# EAGLE design prg (EAGLE 7.1.0)
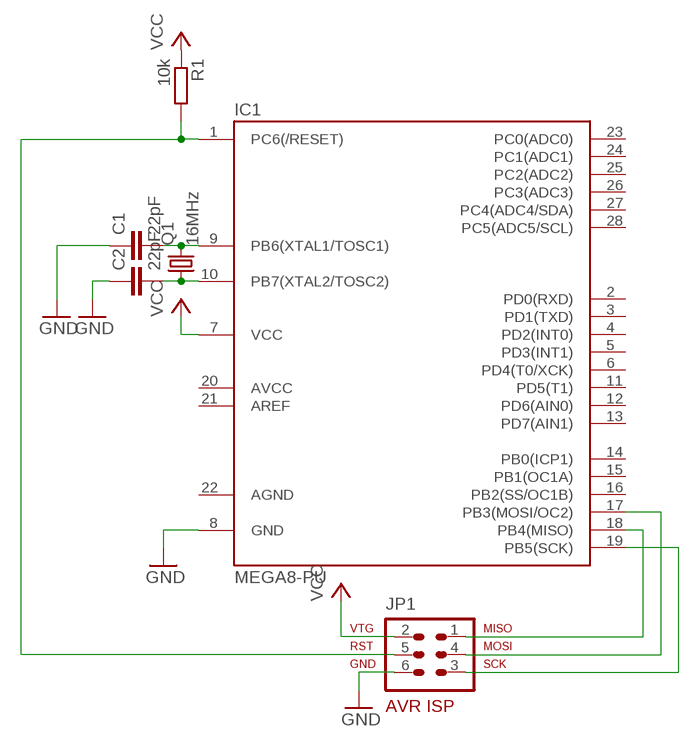
[diagram p0: schematic, sheet 1]

## Parts
C1  22pF  C-EU025-025X050  [C025-025X050]
C2  22pF  C-EU050-025X075  [C050-025X075]
IC1  MEGA8-PU  [DIL28-3]
JP1  AVR-ISP-6  [AVR-ISP-6]
Q1  16MHz  CRYSTALHC49S  [HC49/S]
R1  10k  R-EU_0204/7  [0204/7]

## Nets
GND: C1.1 C2.1 IC1.8(GND) JP1.6
N$1: IC1.19(PB5(SCK)) JP1.3
N$2: IC1.17(PB3(MOSI/OC2)) JP1.4
N$3: IC1.18(PB4(MISO)) JP1.1
N$4: C2.2 IC1.10(PB7(XTAL2/TOSC2)) Q1.1
N$5: C1.2 IC1.9(PB6(XTAL1/TOSC1)) Q1.2
N$7: IC1.1(PC6(/RESET)) JP1.5 R1.2
VCC: IC1.7(VCC) JP1.2 R1.1
Unconnected: IC1.2(PD0(RXD)) IC1.3(PD1(TXD)) IC1.4(PD2(INT0)) IC1.5(PD3(INT1)) IC1.6(PD4(T0/XCK)) IC1.11(PD5(T1)) IC1.12(PD6(AIN0)) IC1.13(PD7(AIN1)) IC1.14(PB0(ICP1)) IC1.15(PB1(OC1A)) IC1.16(PB2(SS/OC1B)) IC1.20(AVCC) IC1.21(AREF) IC1.23(PC0(ADC0)) IC1.24(PC1(ADC1)) IC1.25(PC2(ADC2)) IC1.26(PC3(ADC3)) IC1.27(PC4(ADC4/SDA)) IC1.28(PC5(ADC5/SCL))

## Power pins joined to a net without a drawn wire
AGND: IC1.22(AGND)

## Library data of the parts
C1 C2 = rcl:C-EU: CAPACITOR, European symbol
IC1 = avr-6:MEGA8-PU
JP1 = avr-6:AVR-ISP-6: AVR ISP-6 Serial Programming Header
Q1 = crystal:CRYSTAL: CRYSTAL; OC_FARNELL: 1667008; OC_NEWARK: unknown
R1 = rcl:R-EU_: RESISTOR, European symbol

## Board
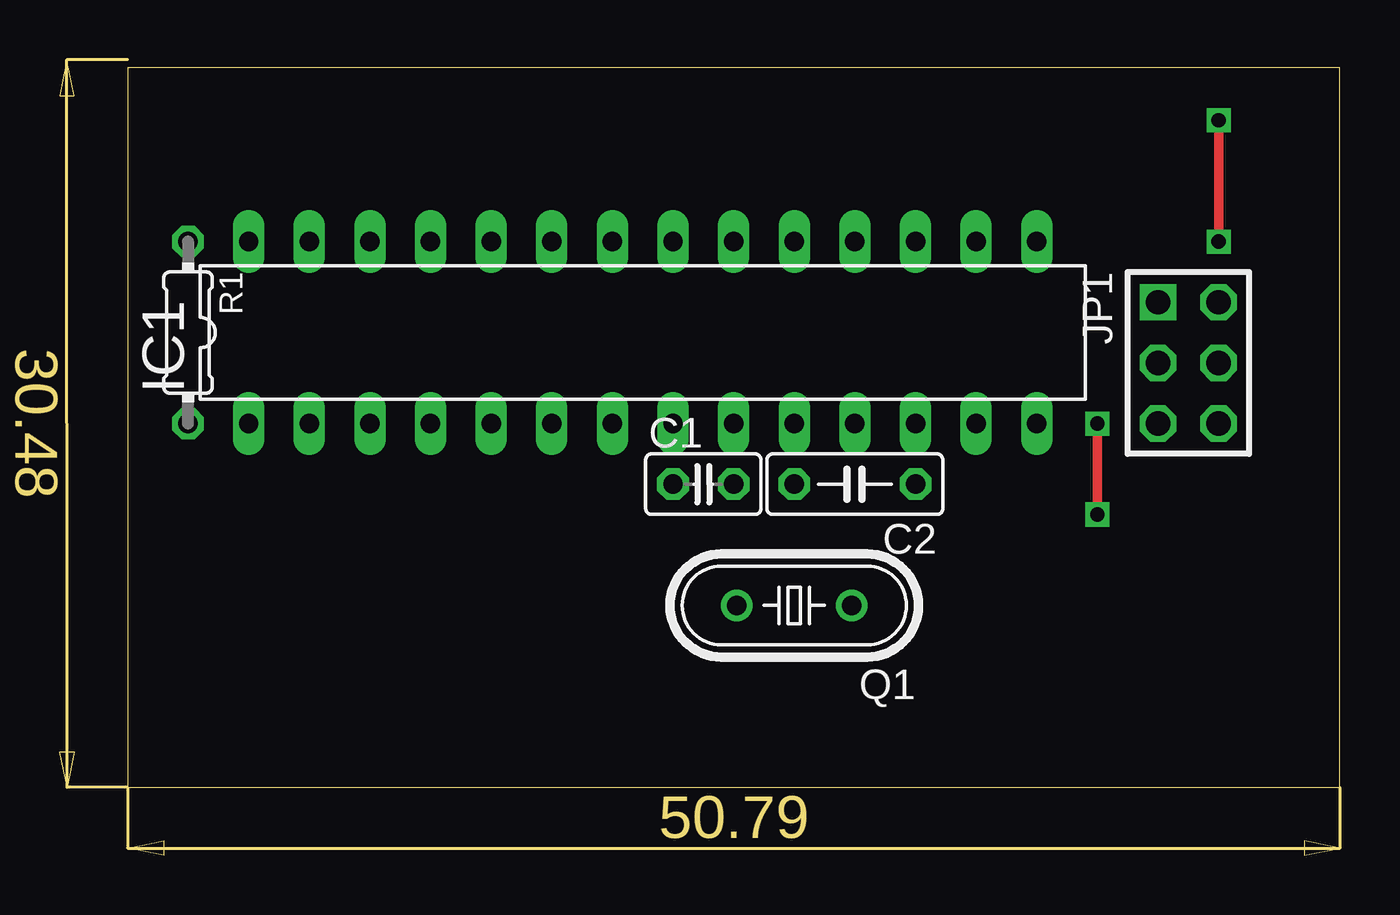
[diagram p1: board, top side]
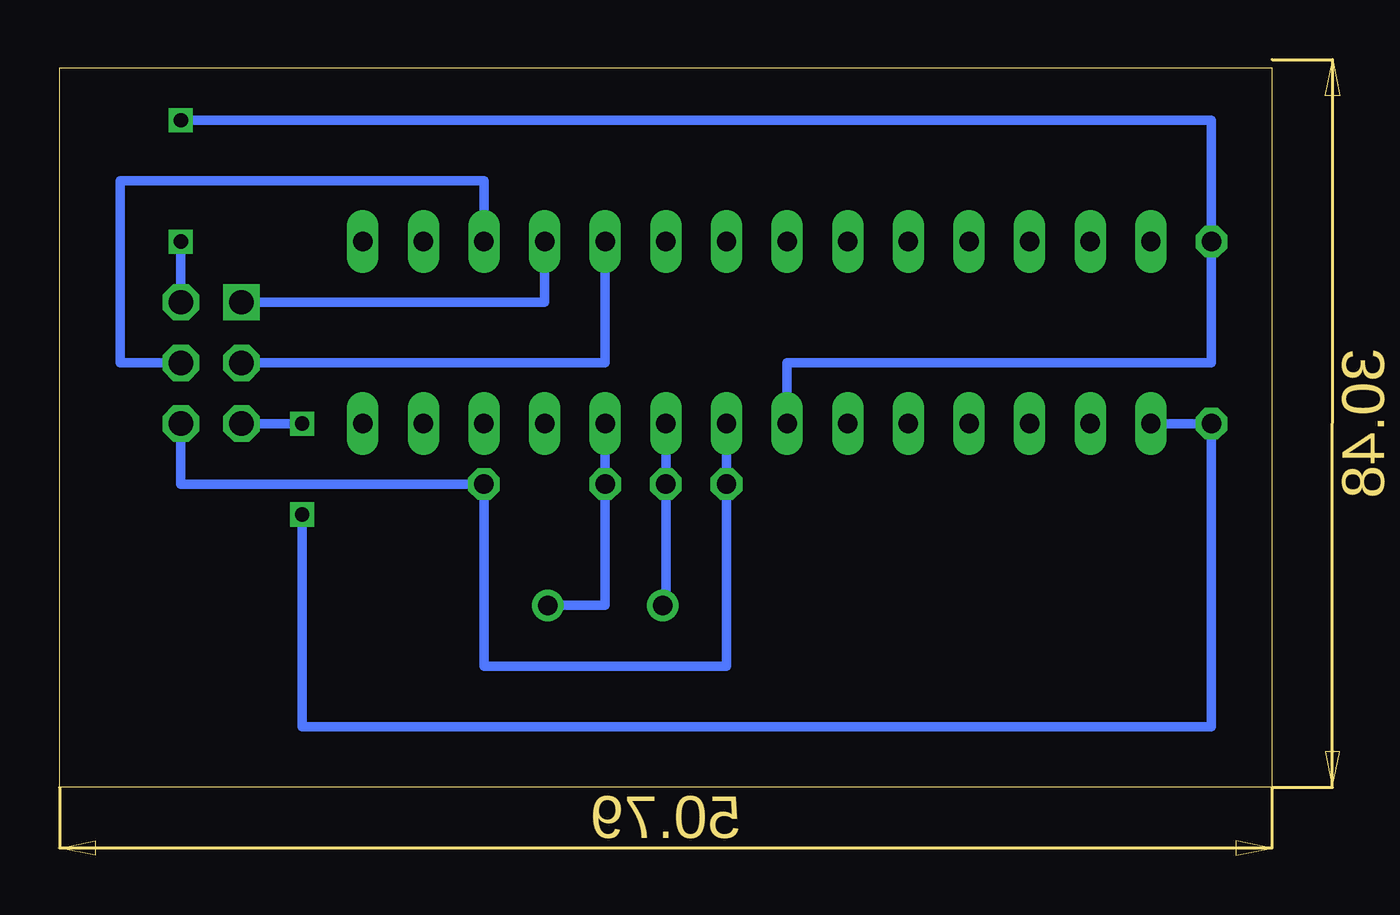
[diagram p2: board, bottom side, seen from below]

Size 50.79 x 30.15 mm. Coordinates in mm from the lower left corner, seen from the top.
Outline: 50.79,0 50.79,30.15 0,30.15 0,0 50.79,0
Copper layers (1*16): Top 0.035mm / dielectric 1.5mm / Bottom 0.035mm
Design rules "default": minimum track width 10mil, minimum drill 24mil, track to track 8mil, track to pad 8mil, pad to pad 8mil, via to via 8mil, smd to smd 8mil, copper to edge 40mil, drill to drill 8mil, minimum pad ring 10mil, minimum via ring 8mil, stop-mask expansion 4mil, vias tented up to drill 0mil, thermal gap 10mil

### Footprints (pad centres in the part's own frame; a part is rotated, then mirrored left to right if it is on the bottom)
C025-025X050 = drill 0.813 octagon: 1 -1.27,0; 2 1.27,0
C050-025X075 = drill 0.813 octagon: 1 -2.54,0; 2 2.54,0
DIL28-3 = drill 0.813 long: 1 -16.51,-3.81; 2 -13.97,-3.81; 3 -11.43,-3.81; 4 -8.89,-3.81; 5 -6.35,-3.81; 6 -3.81,-3.81; 7 -1.27,-3.81; 8 1.27,-3.81; 9 3.81,-3.81; 10 6.35,-3.81; 11 8.89,-3.81; 12 11.43,-3.81; 13 13.97,-3.81; 14 16.51,-3.81; 15 16.51,3.81; 16 13.97,3.81; 17 11.43,3.81; 18 8.89,3.81; 19 6.35,3.81; 20 3.81,3.81; 21 1.27,3.81; 22 -1.27,3.81; 23 -3.81,3.81; 24 -6.35,3.81; 25 -8.89,3.81; 26 -11.43,3.81; 27 -13.97,3.81; 28 -16.51,3.81
AVR-ISP-6 = drill 1.016 square: 1 -2.54,-1.27 | drill 1.016 octagon: 2 -2.54,1.27; 3 0,-1.27; 4 0,1.27; 5 2.54,-1.27; 6 2.54,1.27
HC49/S = drill 0.813: 1 -2.413,0; 2 2.413,0
0204/7 = drill 0.813 octagon: 1 -3.81,0; 2 3.81,0

### Placement (x,y rotation side)
C1  24.12,12.7 0 top
C2  30.47,12.7 180 top
IC1  21.58,19.05 0 top
JP1  44.44,17.78 270 top
Q1  27.93,7.62 180 top
R1  2.53,19.05 270 top

### Tracks (layer width: path | path; a pad name or v marks a point on that pad's centre or on a via)
GND
  Bottom 0.406: JP1.6 45.71,12.7 C2.1 33.01,5.08 22.85,5.08 C1.1 IC1.8
N$1
  Bottom 0.406: IC1.19 27.93,17.78 JP1.3
N$2
  Bottom 0.406: JP1.4 48.25,17.78 48.25,25.4 33.01,25.4 IC1.17
N$3
  Bottom 0.406: IC1.18 30.47,20.32 JP1.1
N$4
  Bottom 0.406: 27.93,7.62 Q1.1 27.93,7.62 | 27.93,7.62 C2.2 | C2.2 IC1.10 | 27.93,7.62 C2.2
N$5
  Bottom 0.406: Q1.2 25.39,7.62 C1.2 IC1.9
N$7  (via drill 0.6)
  Top 0.406: v40.63,15.24 v40.63,11.43
  Bottom 0.406: IC1.1 R1.2 2.53,2.54 40.63,2.54 v40.63,11.43 | JP1.5 v40.63,15.24
VCC  (via drill 0.6)
  Top 0.406: v45.71,22.86 v45.71,27.94
  Bottom 0.406: JP1.2 v45.71,22.86 | v45.71,27.94 25.39,27.94 2.53,27.94 R1.1 2.53,17.78 20.31,17.78 IC1.7